# Altium schematic sheet accelerometer.SchDoc
size A
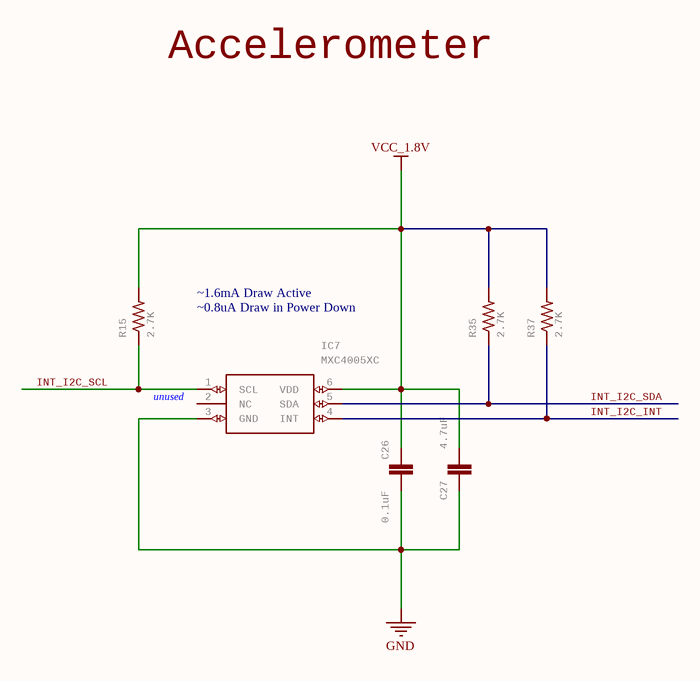
[diagram p0: accelerometer.SchDoc]

## Parts
C26  0.1uF  [0402-CAP]
C27  4.7uF  [0402-CAP]
IC7  MXC4005XC  [MXC4005XC]
R15  2.7K  [R0201]
R35  2.7K  [R0201]
R37  2.7K  [R0201]

## Nets
GND: C26.2 C27.1 IC7.3(GND)
VCC_1.8V: C26.1 C27.2 IC7.6(VDD) R15.2 R35.2 R37.2
INT_I2C_INT: IC7.4(INT) R37.1
INT_I2C_SCL: IC7.1(SCL) R15.1
INT_I2C_SDA: IC7.5(SDA) R35.1

Not connected (* = marked no-connect by the designer): IC7 2(NC)

## Notes on the sheet
- Accelerometer
- ~0.8uA Draw in Power Down
- ~1.6mA Draw Active
- unused

## Library data of the parts
C26 = C-EUC0201: CAPACITOR, European symbol; MPN: C0402C104Z4VAC; GateName_1: G$1; SymbolName_1: C-EU; POPULARITY: 0; LibraryName: rcl; DeviceSetName: C-EU; SPICEPREFIX: C; Part Number: C0402C104Z4VAC
C27 = CAP0402-CAP: CapacitorStandard 0603 ceramic capacitor, and 0.1" leaded capacitor.; MPN: JMK105BBJ475MV-F; GateName_1: G$1; SymbolName_1: CAP; DeviceName: 0402-CAP; LibraryName: sfe; DeviceSetName: CAP; Part Number: JMK105BBJ475MV-F
IC7 = MXC4005XC: Accelerometers Monolithic and Wafer Level Packaged Three-Axis Accelerometer   Source:  Datasheet; MANUFACTURER_NAME: MEMSIC; GateName_1: G$1; SymbolName_1: MXC4005XC; LibraryName: MXC4005XC; DeviceSetName: MXC4005XC; HEIGHT: 0.885mm; MANUFACTURER_PART_NUMBER: MXC4005XC; MOUSER_PART_NUMBER: 438-MXC4005XC; MOUSER_PRICE-STOCK: https://www.mouser.co.uk/ProductDetail/MEMSIC/MXC4005XC?qs=RcG8xmE7yp3iyYgWLmAtUw%3D%3D; MPN: MXC4005XC; Part Number: MXC4005XC
R15 R35 R37 = RESISTOR0402-RES: GateName_1: G$1; SymbolName_1: RESISTOR; LibraryName: sfe; DeviceSetName: RESISTOR